# EAGLE design IRBlaster (EAGLE 8.3.1)
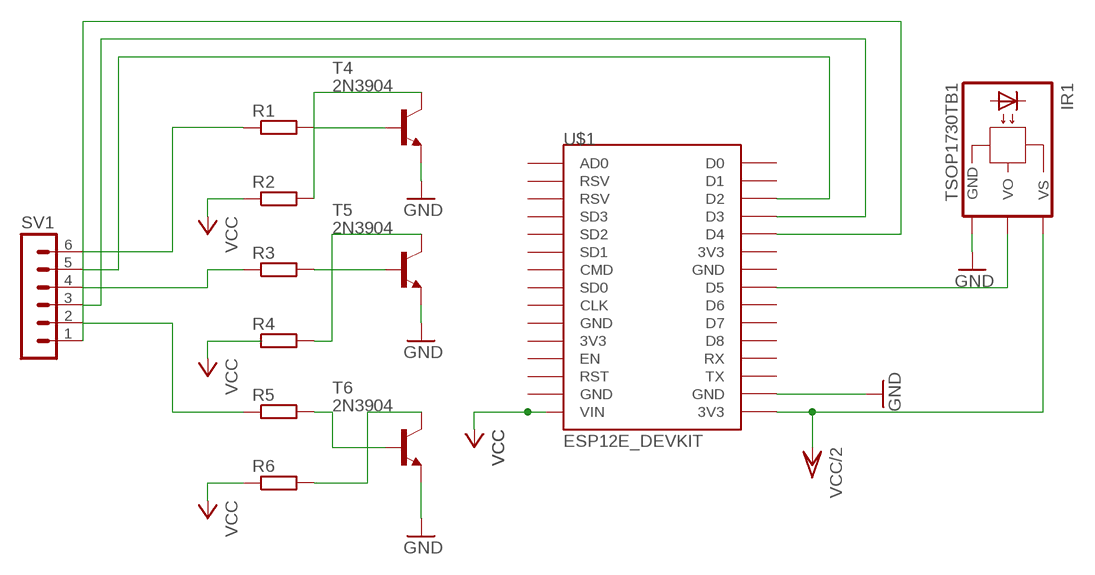
[diagram p0: schematic, sheet 1]

## Parts
IR1  TSOP1730TB1  [TSOP17_TB1]
R1  R-EU_0207/10  [0207/10]
R2  R-EU_0207/10  [0207/10]
R3  R-EU_0207/10  [0207/10]
R4  R-EU_0207/10  [0207/10]
R5  R-EU_0207/10  [0207/10]
R6  R-EU_0207/10  [0207/10]
SV1  MA06-1  [MA06-1]
T4  2N3904  [TO92]
T5  2N3904  [TO92]
T6  2N3904  [TO92]
U$1  ESP12E_DEVKIT  [ESP12E_DEVKIT]

## Nets
GND: IR1.GND T4.3(E) T5.3(E) T6.3(E) U$1.GND@3(GND)
N$1: IR1.VO U$1.D5
N$2: R1.2 T4.2(B)
N$3: R3.2 T5.2(B)
N$4: R5.2 T6.2(B)
N$5: R1.1 SV1.6
N$6: R3.1 SV1.4
N$7: R5.1 SV1.2
N$8: SV1.5 U$1.D2
N$9: R2.2 T4.1(C)
N$10: SV1.3 U$1.D3
N$11: R4.2 T5.1(C)
N$12: SV1.1 U$1.D4
N$13: R6.2 T6.1(C)
N$14: R2.1
VCC: R6.1 U$1.VIN
VCC/2: IR1.VS U$1.3V3@2(3V3)
Unconnected: R4.1 U$1.3V3@0(3V3) U$1.3V3@1(3V3) U$1.AD0 U$1.CLK U$1.CMD U$1.D0 U$1.D1 U$1.D6 U$1.D7 U$1.D8 U$1.EN U$1.GND@0(GND) U$1.GND@1(GND) U$1.GND@2(GND) U$1.RST U$1.RSV@0(RSV) U$1.RSV@1(RSV) U$1.RX U$1.SD0 U$1.SD1 U$1.SD2 U$1.SD3 U$1.TX

## Library data of the parts
IR1 = telefunken:TSOP17*TB1: TSOP17..TB1 IR Receiver Modules for Remote Control Systems Source: http://www.vishay.com/docs/82042/82042.pdf; OC_FARNELL: unknown; OC_NEWARK: unknown
R1-R6 = resistor:R-EU_: RESISTOR, European symbol
SV1 = con-lstb:MA06-1: PIN HEADER; OC_FARNELL: unknown; OC_NEWARK: unknown
T4-T6 = transistor:2N3904: NPN TRANSISTOR
U$1 = ESP12E_DEVKIT:ESP12E_DEVKIT: ESP12E DEVKIT BOARD

## Board
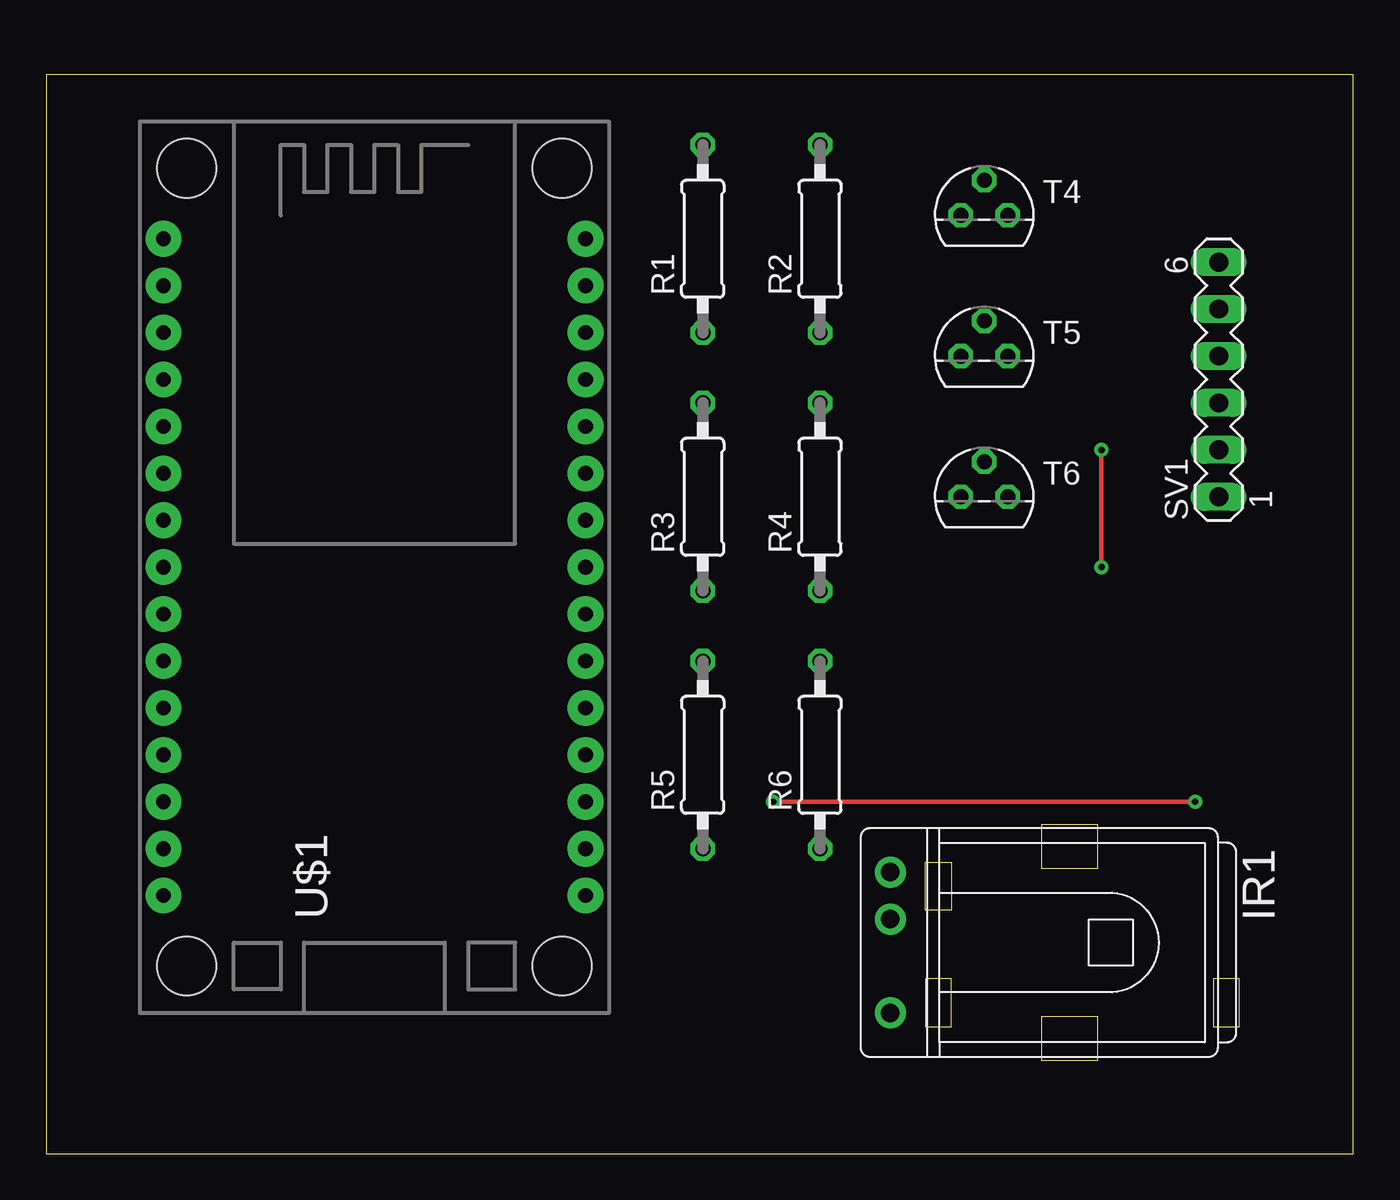
[diagram p1: board, top side]
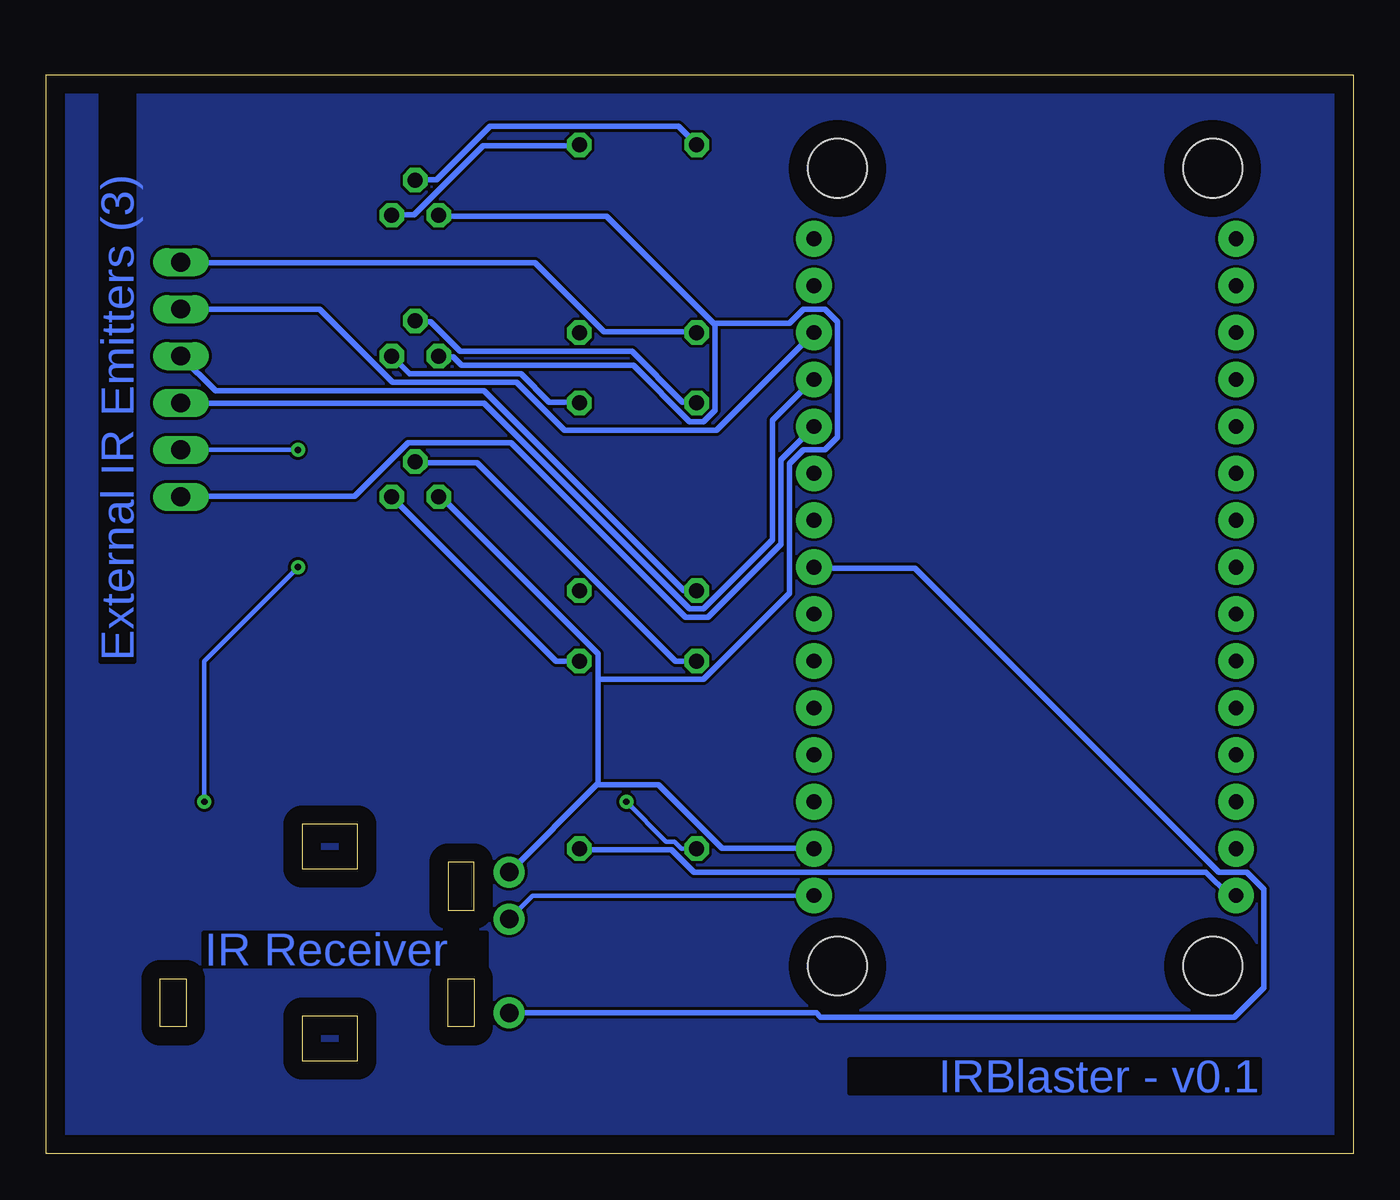
[diagram p2: board, bottom side, seen from below]

Size 70.79 x 58.41 mm. Coordinates in mm from the lower left corner, seen from the top.
Outline: 0,0 70.79,0 70.79,58.41 0,58.41 0,0
Copper layers (1*16): Top 0.035mm / dielectric 1.5mm / Bottom 0.035mm
Design rules "default *": minimum track width 12mil, minimum drill 0.6mm, track to track 6mil, track to pad 6mil, pad to pad 6mil, via to via 6mil, smd to smd 6mil, copper to edge 40mil, drill to drill 6mil, minimum pad ring 10mil, minimum via ring 8mil, stop-mask expansion 4mil, vias tented up to drill 0mil, thermal gap 10mil

### Footprints (pad centres in the part's own frame; a part is rotated, then mirrored left to right if it is on the bottom)
TSOP17_TB1 = drill 1 pad 1.676: GND 0,-3.81; VO 0,3.81; VS 0,-1.27
0207/10 = drill 0.813 octagon: 1 -5.08,0; 2 5.08,0
MA06-1 = drill 1.016 long: 1 -6.35,0; 2 -3.81,0; 3 -1.27,0; 4 1.27,0; 5 3.81,0; 6 6.35,0
TO92 = drill 0.813 octagon: 1 1.27,0; 2 0,1.905; 3 -1.27,0
ESP12E_DEVKIT = drill 0.8 pad 1.93: 3V3@0 -11.43,-7.62; 3V3@1 11.43,5.08; 3V3@2 11.43,-17.78; AD0 -11.43,17.78; CLK -11.43,-2.54; CMD -11.43,2.54; D0 11.43,17.78; D1 11.43,15.24; D2 11.43,12.7; D3 11.43,10.16; D4 11.43,7.62; D5 11.43,0; D6 11.43,-2.54; D7 11.43,-5.08; D8 11.43,-7.62; EN -11.43,-10.16; GND@0 -11.43,-5.08; GND@1 -11.43,-15.24; GND@2 11.43,2.54; GND@3 11.43,-15.24; RST -11.43,-12.7; RSV@0 -11.43,15.24; RSV@1 -11.43,12.7; RX 11.43,-10.16; SD0 -11.43,0; SD1 -11.43,5.08; SD2 -11.43,7.62; SD3 -11.43,10.16; TX 11.43,-12.7; VIN -11.43,-17.78 | hole 3.2: -10.16,21.59; 10.16,21.59; 10.16,-21.59; -10.16,-21.59

### Placement (x,y rotation side)
IR1  45.72,11.43 180 top
R1  35.56,49.53 90 top
R2  41.91,49.53 90 top
R3  35.56,35.56 90 top
R4  41.91,35.56 90 top
R5  35.56,21.59 90 top
R6  41.91,21.59 90 top
SV1  63.5,41.91 90 top
T4  50.8,50.8 0 top
T5  50.8,43.18 0 top
T6  50.8,35.56 0 top
U$1  17.78,31.75 0 top

### Tracks (layer width: path | path; a pad name or v marks a point on that pad's centre or on a via)
GND
  Bottom 0.305: 34.57,44.88 34.57,40.23 35.18,39.62 35.94,39.62 38.99,42.67 48.29,42.67 48.74,43.13 49.51,43.13 T5.3 | 34.57,44.88 40.44,50.75 49.51,50.75 T4.3 | 40.89,20.04 40.89,25.68 | 40.89,25.68 40.89,27.05 49.35,35.51 49.51,35.51 T6.3 | 40.89,20.04 45.7,15.24 IR1.GND | U$1.GND@3 29.23,16.54 34.19,16.54 37.62,19.96 40.82,19.96 40.89,20.04 | 40.89,25.68 35.18,25.68 30.53,30.33 30.53,37.34 29.77,38.1 28.63,38.1 27.94,38.79 27.94,45.03 28.63,45.72 29.77,45.72 30.53,44.96 34.49,44.96 34.57,44.88
N$1
  Bottom 0.305: IR1.VO 29.08,7.62 28.85,7.39 6.45,7.39 4.85,8.99 4.85,14.33 5.77,15.24 7.29,15.24 23.75,31.7 29.16,31.7 U$1.D5
N$2
  Bottom 0.305: T4.2 50.8,52.73 49.66,52.73 46.76,55.63 36.55,55.63 35.56,54.63 R1.2
N$3
  Bottom 0.305: R3.2 35.56,40.69 36.32,40.69 39.06,43.43 48.36,43.43 49.96,45.03 50.8,45.03 T5.2
N$4
  Bottom 0.305: R5.2 36.7,26.67 47.45,37.41 50.8,37.41 T6.2
N$5
  Bottom 0.305: R1.1 35.56,44.5 40.59,44.5 44.32,48.23 63.45,48.23 SV1.6
N$6
  Bottom 0.305: R3.1 36.25,30.48 47.07,41.3 61.62,41.3 SV1.4
N$7  (via drill 0.35)
  Top 0.254: v39.37,19.05 v62.23,19.05 | v57.15,31.75 v57.15,38.1
  Bottom 0.254: R5.1 36.37,16.51 36.75,16.89 37.21,16.89 v39.37,19.05 | v62.23,19.05 62.23,26.67 v57.15,31.75 | v57.15,38.1 SV1.2
N$8
  Bottom 0.305: SV1.5 55.98,45.72 52.02,41.76 45.31,41.76 42.72,39.17 34.49,39.17 U$1.D2
N$9
  Bottom 0.305: T4.1 52.02,50.83 50.88,50.83 47.14,54.56 41.96,54.56 R2.2
N$10
  Bottom 0.305: SV1.3 63.45,40.62 47.07,40.62 35.94,29.49 35.18,29.49 31.45,33.22 31.45,39.7 29.23,41.91 U$1.D3
N$11
  Bottom 0.305: T5.1 51.11,42.22 45.09,42.22 43.56,40.69 41.96,40.69 R4.2
N$12
  Bottom 0.305: SV1.1 63.45,35.59 54.08,35.59 51.18,38.48 45.62,38.48 36.17,29.03 34.95,29.03 30.99,32.99 30.99,37.57 29.23,39.32 U$1.D4
N$13
  Bottom 0.305: R6.2 43.18,26.67 T6.1
N$15
  pour Bottom: 0,58.42 0,0 71.12,0 71.12,58.42
VCC
  Bottom 0.305: R6.1 41.88,16.46 36.93,16.46 35.71,15.24 7.98,15.24 6.76,14.02 6.37,14.02 U$1.VIN
VCC/2
  Bottom 0.254: U$1.3V3@2 44.45,13.97 IR1.VS

### Text on the board
Bottom: External IR Emitters (3) | IR Receiver | IRBlaster - v0.1